# EAGLE schematic ARM926SBC (EAGLE 7.6.0)

## Sheet 1 of 3
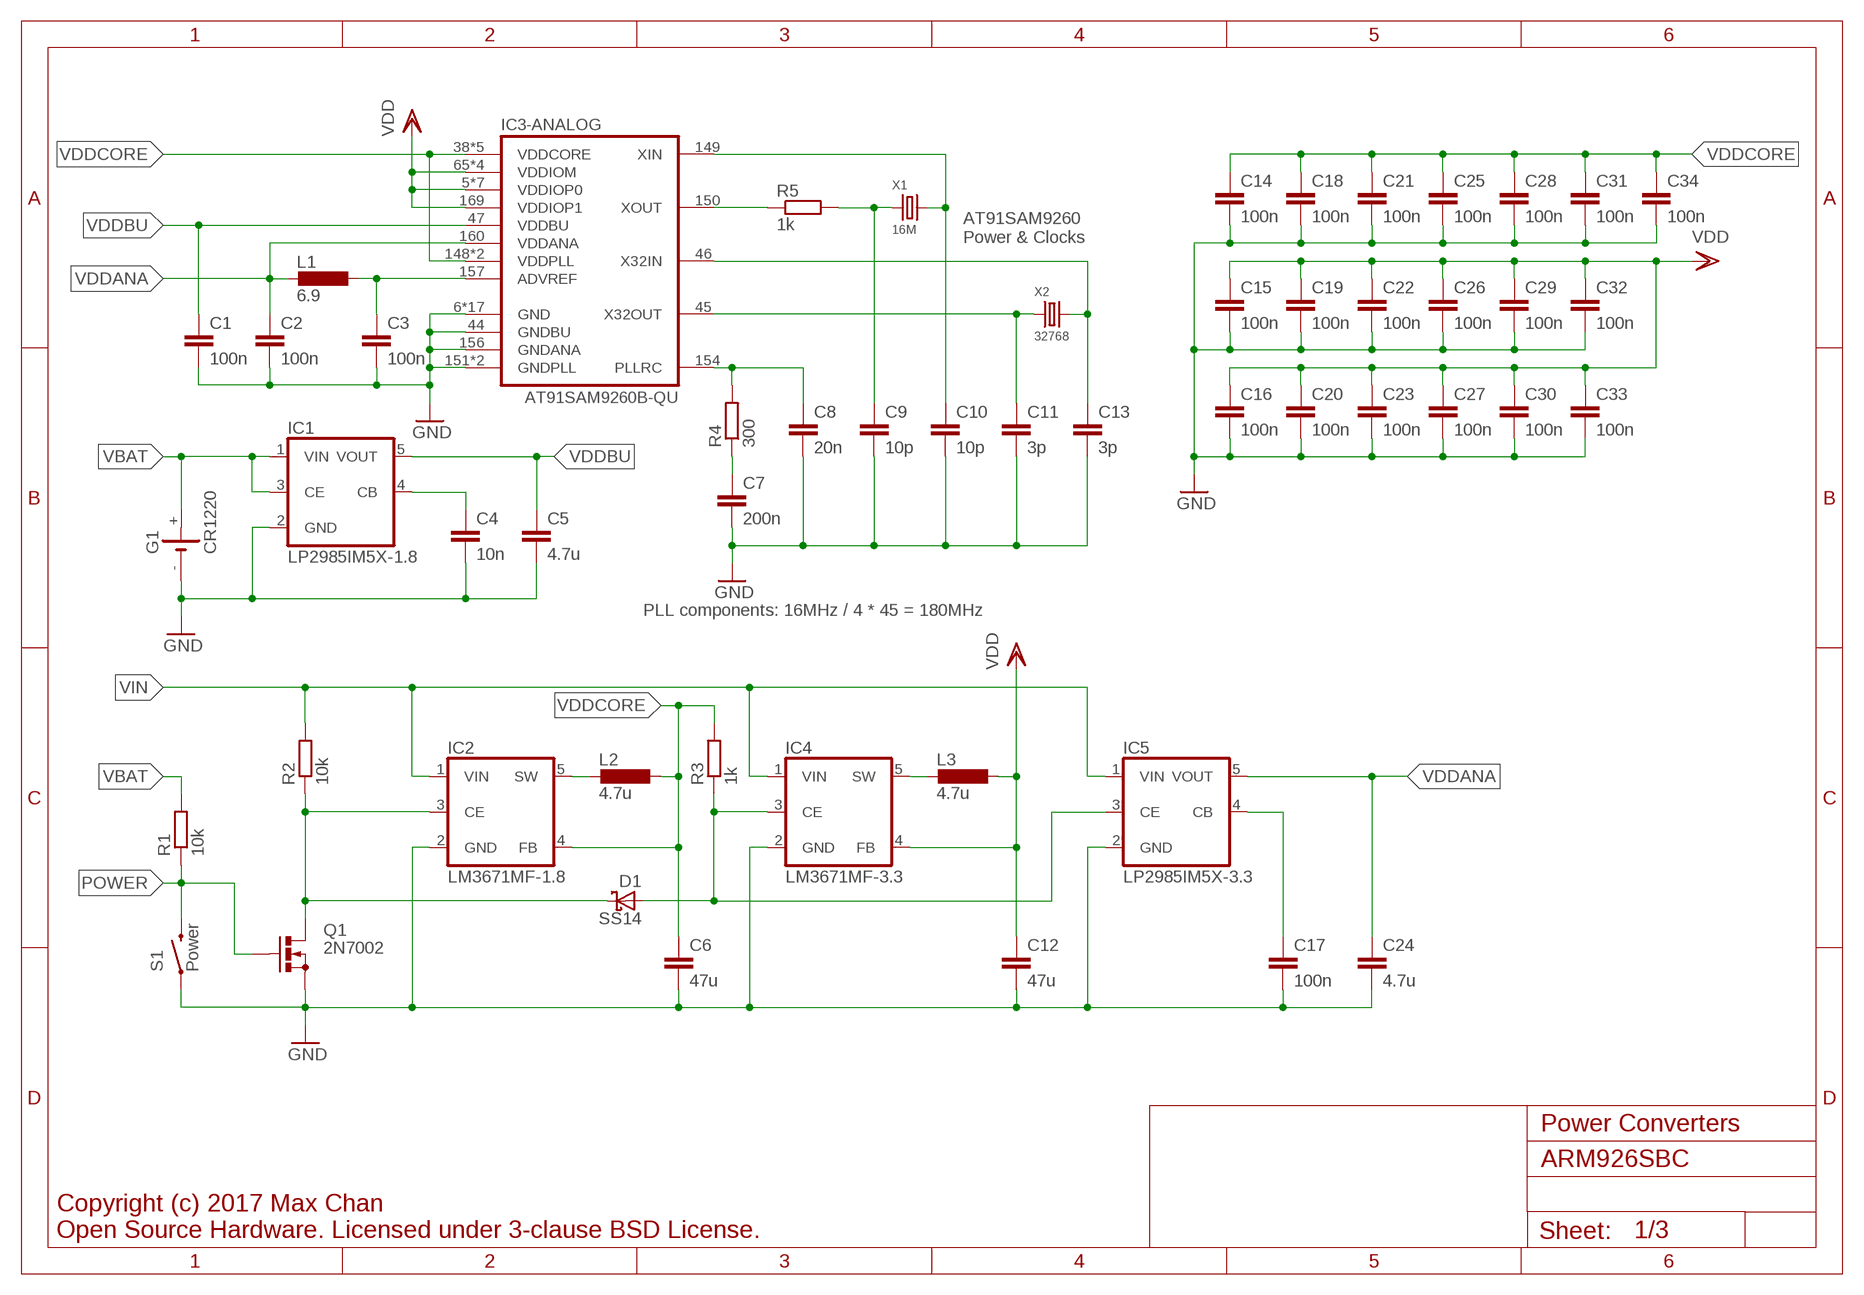
[diagram p0: schematic, sheet 1]

### Parts
C1  100n  C-EUC0603  [C0603]
C2  100n  C-EUC0603  [C0603]
C3  100n  C-EUC0603  [C0603]
C4  10n  C-EUC0603  [C0603]
C5  4.7u  C-EUC0603  [C0603]
C6  47u  C-EUC1206  [C1206]
C7  200n  C-EUC0603  [C0603]
C8  20n  C-EUC0603  [C0603]
C9  10p  C-EUC0603  [C0603]
C10  10p  C-EUC0603  [C0603]
C11  3p  C-EUC0603  [C0603]
C12  47u  C-EUC1206  [C1206]
C13  3p  C-EUC0603  [C0603]
C14  100n  C-EUC0603  [C0603]
C15  100n  C-EUC0603  [C0603]
C16  100n  C-EUC0603  [C0603]
C17  100n  C-EUC0603  [C0603]
C18  100n  C-EUC0603  [C0603]
C19  100n  C-EUC0603  [C0603]
C20  100n  C-EUC0603  [C0603]
C21  100n  C-EUC0603  [C0603]
C22  100n  C-EUC0603  [C0603]
C23  100n  C-EUC0603  [C0603]
C24  4.7u  C-EUC0603  [C0603]
C25  100n  C-EUC0603  [C0603]
C26  100n  C-EUC0603  [C0603]
C27  100n  C-EUC0603  [C0603]
C28  100n  C-EUC0603  [C0603]
C29  100n  C-EUC0603  [C0603]
C30  100n  C-EUC0603  [C0603]
C31  100n  C-EUC0603  [C0603]
C32  100n  C-EUC0603  [C0603]
C33  100n  C-EUC0603  [C0603]
C34  100n  C-EUC0603  [C0603]
D1  SS14  SCHOTTKY-DIODEDO214AC  [DO214AC]
G1  CR1220  CH291-1220LF  [CH291-1220LF]
IC1  LP2985IM5X-1.8  [SOT23-5L]
IC2  LM3671MF-1.8  [SOT23-5L]
IC3  AT91SAM9260B-QU  [PQFP208]
IC4  LM3671MF-3.3  [SOT23-5L]
IC5  LP2985IM5X-3.3  [SOT23-5L]
L1  6.9  L-EUR0603  [R0603]
L2  4.7u  L-EUL5650M  [L5650M]
L3  4.7u  L-EUL5650M  [L5650M]
Q1  2N7002  [SOT23]
R1  10k  R-EU_R0603  [R0603]
R2  10k  R-EU_R0603  [R0603]
R3  1k  R-EU_R0603  [R0603]
R4  300  R-EU_R0603  [R0603]
R5  1k  R-EU_R0603  [R0603]
S1  Power  SWITCH-MOMENTARY-2SMD-1101NE  [TACTILE-SWITCH-1101NE]
X1  16M  CRYSTAL-3225  [CRYSTAL-3225]
X2  32768  CRYSTAL-3215  [CRYSTAL-3215]

### Nets
ADVREF: C3.1 IC3.157(-ANALOG:ADVREF) L1.1
GND: C1.2 C2.2 C3.2 C4.2 C5.2 C6.2 C7.2 C8.2 C9.2 C10.2 C11.2 C12.2 C13.2 C14.2 C15.2 C16.2 C17.2 C18.2 C19.2 C20.2 C21.2 C22.2 C23.2 C24.2 C25.2 C26.2 C27.2 C28.2 C29.2 C30.2 C31.2 C32.2 C33.2 C34.2 G1.- IC1.2(GND) IC2.2(GND) IC3.6(-ANALOG:GND) IC3.14(-ANALOG:GND) IC3.25(-ANALOG:GND) IC3.33(-ANALOG:GND) IC3.39(-ANALOG:GND) IC3.44(-ANALOG:GNDBU) IC3.53(-ANALOG:GND) IC3.66(-ANALOG:GND) IC3.78(-ANALOG:GND) IC3.91(-ANALOG:GND) IC3.113(-ANALOG:GND) IC3.133(-ANALOG:GND) IC3.146(-ANALOG:GND) IC3.151(-ANALOG:GNDPLL) IC3.153(-ANALOG:GNDPLL) IC3.156(-ANALOG:GNDANA) IC3.170(-ANALOG:GND) IC3.173(-ANALOG:GND) IC3.188(-ANALOG:GND) IC3.200(-ANALOG:GND) IC3.204(-ANALOG:GND) IC4.2(GND) IC5.2(GND) Q1.2(S) S1.1 ; also sheet 2,3
N$1: C8.1 IC3.154(-ANALOG:PLLRC) R4.2
N$2: C7.1 R4.1
N$3: IC3.150(-ANALOG:XOUT) R5.1
N$4: C9.1 R5.2 X1.1
N$5: C10.1 IC3.149(-ANALOG:XIN) X1.3
N$6: C11.1 IC3.45(-ANALOG:X32OUT) X2.1
N$7: C13.1 IC3.46(-ANALOG:X32IN) X2.2
N$9: C4.1 IC1.4(CB)
N$10: D1.A IC4.3(CE) IC5.3(CE) R3.1
N$11: IC2.5(SW) L2.2
N$13: IC4.5(SW) L3.2
N$14: C17.1 IC5.4(CB)
N$15: D1.C IC2.3(CE) Q1.3(D) R2.1
POWER: Q1.1(G) R1.1 S1.2
VBAT: G1.+ IC1.1(VIN) IC1.3(CE) R1.2
VDD: C12.1 C15.1 C16.1 C19.1 C20.1 C22.1 C23.1 C26.1 C27.1 C29.1 C30.1 C32.1 C33.1 IC3.5(-ANALOG:VDDIOP0) IC3.13(-ANALOG:VDDIOP0) IC3.24(-ANALOG:VDDIOP0) IC3.32(-ANALOG:VDDIOP0) IC3.52(-ANALOG:VDDIOP0) IC3.65(-ANALOG:VDDIOM) IC3.90(-ANALOG:VDDIOM) IC3.114(-ANALOG:VDDIOM) IC3.132(-ANALOG:VDDIOM) IC3.169(-ANALOG:VDDIOP1) IC3.187(-ANALOG:VDDIOP0) IC3.199(-ANALOG:VDDIOP0) IC4.4(FB) L3.1 ; also sheet 2,3
VDDANA: C2.1 C24.1 IC3.160(-ANALOG:VDDANA) IC5.5(VOUT) L1.2
VDDBU: C1.1 C5.1 IC1.5(VOUT) IC3.47(-ANALOG:VDDBU)
VDDCORE: C6.1 C14.1 C18.1 C21.1 C25.1 C28.1 C31.1 C34.1 IC2.4(FB) IC3.38(-ANALOG:VDDCORE) IC3.77(-ANALOG:VDDCORE) IC3.147(-ANALOG:VDDCORE) IC3.148(-ANALOG:VDDPLL) IC3.155(-ANALOG:VDDPLL) IC3.174(-ANALOG:VDDCORE) IC3.203(-ANALOG:VDDCORE) L2.1 R3.2
VIN: IC2.1(VIN) IC4.1(VIN) IC5.1(VIN) R2.2
Unconnected: IC3.9(-PORTB:PB0/SPI1_MISO/TIOA3) IC3.10(-PORTB:PB1/SPI1_MOSI/TIOB3) IC3.11(-PORTB:PB2/SPI1_SCK/TIOA4) IC3.12(-PORTB:PB3/SPI1_CS0/TIOA5) IC3.15(-PORTB:PB4/TXD0) IC3.16(-PORTB:PB5/RXD0) IC3.17(-PORTB:PB6/TXD1/TCLK1) IC3.18(-PORTB:PB7/RXD1/TCLK2) IC3.19(-PORTB:PB8/TXD2) IC3.20(-PORTB:PB9/RXD2) IC3.21(-PORTB:PB14/DRXD) IC3.22(-PORTB:PB15/DTXD) IC3.23(-PORTB:PB16/TK0/TCLK3) IC3.26(-PORTB:PB17/TF0/TCLK4) IC3.27(-PORTB:PB18/TD0/TIOB4) IC3.28(-PORTB:PB19/RD0/TIOB5) IC3.29(-MISC:TDO) IC3.30(-MISC:TDI) IC3.31(-MISC:TMS) IC3.34(-MISC:TCK) IC3.35(-MISC:TRST#) IC3.36(-MISC:RST#) IC3.37(-MISC:RTCK) IC3.40(-MISC:BMS) IC3.41(-MISC:OSCSEL) IC3.42(-MISC:TST) IC3.43(-MISC:JTAGSEL) IC3.48(-MISC:WKUP) IC3.49(-MISC:SHDN) IC3.50(-MISC:HD-) IC3.51(-MISC:HD+) IC3.54(-MISC:UD-) IC3.55(-MISC:UD+) IC3.56(-PORTC:PC13/FIQ/CS#6) IC3.57(-PORTC:PC11/CS#2/SPI0_CS1) IC3.58(-PORTC:PC10/A25/CTS3) IC3.59(-PORTC:PC14/CS#3/IRQ2) IC3.60(-PORTC:PC9/CS#5/TIOB0) IC3.61(-PORTC:PC8/CS#4/RTS3) IC3.62(-PORTC:PC4/A23/SPI1_CS2) IC3.63(-PORTC:PC6/TIOB2/CFCE1) IC3.64(-PORTC:PC7/TIOB1/CFCE2) IC3.67(-PORTC:PC5/A24/SPI1_CS1) IC3.127(-PORTC:PC15/WAIT#/IRQ1) IC3.128(-PORTC:PC16/D16/SPI0_CS2) IC3.129(-PORTC:PC17/D17/SPI0_CS3) IC3.130(-PORTC:PC18/D18/SPI1_CS1) IC3.131(-PORTC:PC19/D19/SPI1_CS2) IC3.134(-PORTC:PC20/D20/SPI1_CS3) IC3.135(-PORTC:PC21/D21/EF100) IC3.136(-PORTC:PC22/D22/TCLK5) IC3.137(-PORTC:PC23/D23) IC3.138(-PORTC:PC24/D24) IC3.139(-PORTC:PC25/D25) IC3.140(-PORTC:PC26/D26) IC3.141(-PORTC:PC27/D27) IC3.142(-PORTC:PC28/D28) IC3.143(-PORTC:PC29/D29) IC3.144(-PORTC:PC30/D30) IC3.145(-PORTC:PC31/D31) IC3.158(-PORTC:PC0/ADC0/SCK3) IC3.159(-PORTC:PC1/ADC1/PCK0) IC3.161(-PORTB:PB10/TXD3/ISI_D8) IC3.162(-PORTB:PB11/RXD3/ISI_D9) IC3.163(-PORTB:PB20/RK0/ISI_D0) IC3.164(-PORTB:PB21/RF0/ISI_D1) IC3.165(-PORTB:PB22/DSR0/ISI_D2) IC3.166(-PORTB:PB23/DCD0/ISI_D3) IC3.167(-PORTB:PB24/DTR0/ISI_D4) IC3.168(-PORTB:PB25/RI0/ISI_D5) IC3.171(-PORTB:PB26/RTS0/ISI_D6) IC3.172(-PORTB:PB27/CTS0/ISI_D7) IC3.175(-PORTB:PB28/RTS1/ISI_PCK) IC3.176(-PORTB:PB29/CTS1/ISI_VSY) IC3.177(-PORTB:PB30/PCK0/ISI_HSY) IC3.178(-PORTB:PB31/PCK1)

### Notes on the sheet
- AT91SAM9260
  Power & Clocks
- PLL components: 16MHz / 4 * 45 = 180MHz
- Power Converters
- Copyright (c) 2017 Max Chan
  Open Source Hardware. Licensed under 3-clause BSD License.

## Sheet 2 of 3
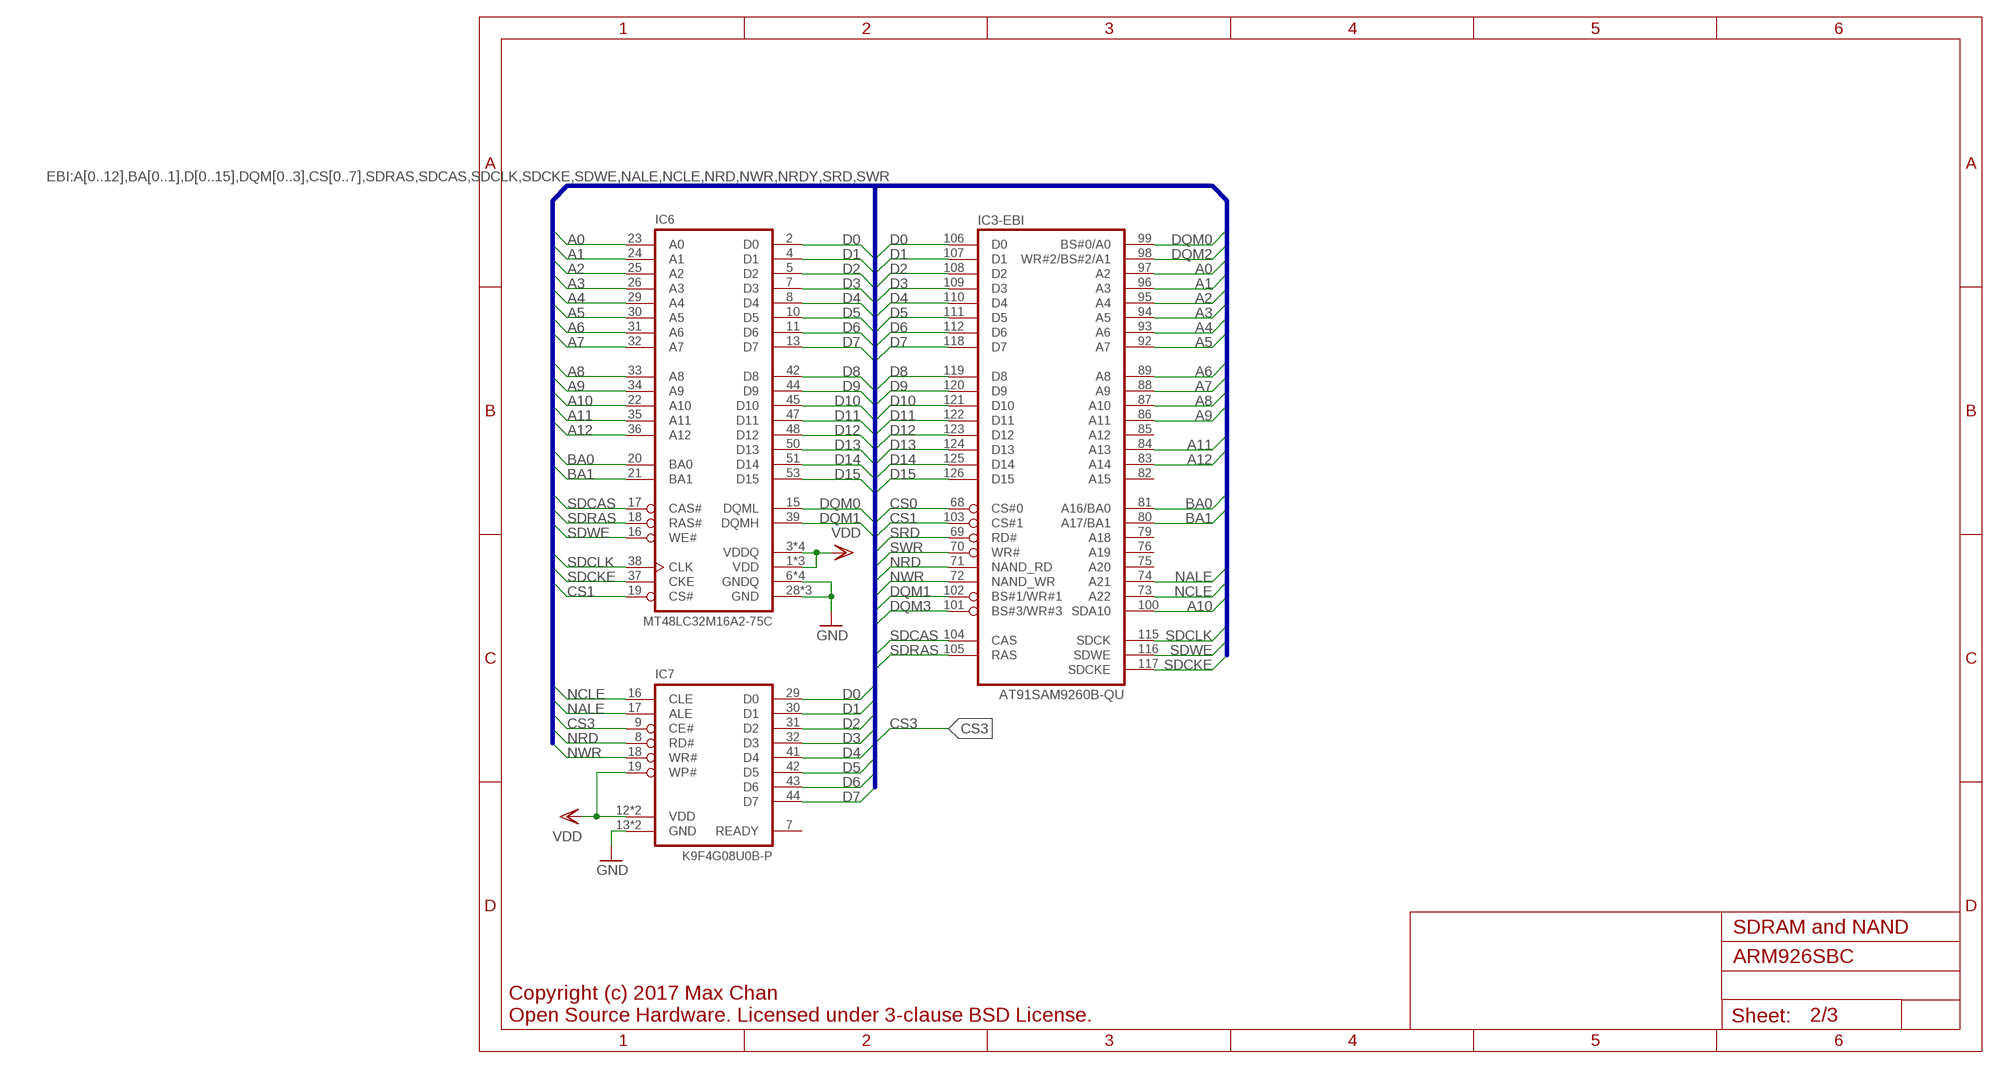
[diagram p1: schematic, sheet 2]

### Parts
IC6  MT48LC32M16A2-75C  [TSOP54-400]
IC7  K9F4G08U0B-P  [TSOP48]

### Nets
A0: IC3.97(-EBI:A2) IC6.23(A0)
A1: IC3.96(-EBI:A3) IC6.24(A1)
A2: IC3.95(-EBI:A4) IC6.25(A2)
A3: IC3.94(-EBI:A5) IC6.26(A3)
A4: IC3.93(-EBI:A6) IC6.29(A4)
A5: IC3.92(-EBI:A7) IC6.30(A5)
A6: IC3.89(-EBI:A8) IC6.31(A6)
A7: IC3.88(-EBI:A9) IC6.32(A7)
A8: IC3.87(-EBI:A10) IC6.33(A8)
A9: IC3.86(-EBI:A11) IC6.34(A9)
A10: IC3.100(-EBI:SDA10) IC6.22(A10)
A11: IC3.84(-EBI:A13) IC6.35(A11)
A12: IC3.83(-EBI:A14) IC6.36(A12)
BA0: IC3.81(-EBI:A16/BA0) IC6.20(BA0)
BA1: IC3.80(-EBI:A17/BA1) IC6.21(BA1)
CS0: IC3.68(-EBI:CS#0)
CS1: IC3.103(-EBI:CS#1) IC6.19(CS#)
CS3: IC7.9(CE#)
D0: IC3.106(-EBI:D0) IC6.2(D0) IC7.29(D0)
D1: IC3.107(-EBI:D1) IC6.4(D1) IC7.30(D1)
D2: IC3.108(-EBI:D2) IC6.5(D2) IC7.31(D2)
D3: IC3.109(-EBI:D3) IC6.7(D3) IC7.32(D3)
D4: IC3.110(-EBI:D4) IC6.8(D4) IC7.41(D4)
D5: IC3.111(-EBI:D5) IC6.10(D5) IC7.42(D5)
D6: IC3.112(-EBI:D6) IC6.11(D6) IC7.43(D6)
D7: IC3.118(-EBI:D7) IC6.13(D7) IC7.44(D7)
D8: IC3.119(-EBI:D8) IC6.42(D8)
D9: IC3.120(-EBI:D9) IC6.44(D9)
D10: IC3.121(-EBI:D10) IC6.45(D10)
D11: IC3.122(-EBI:D11) IC6.47(D11)
D12: IC3.123(-EBI:D12) IC6.48(D12)
D13: IC3.124(-EBI:D13) IC6.50(D13)
D14: IC3.125(-EBI:D14) IC6.51(D14)
D15: IC3.126(-EBI:D15) IC6.53(D15)
DQM0: IC3.99(-EBI:BS#0/A0) IC6.15(DQML)
DQM1: IC3.102(-EBI:BS#1/WR#1) IC6.39(DQMH)
DQM2: IC3.98(-EBI:WR#2/BS#2/A1)
DQM3: IC3.101(-EBI:BS#3/WR#3)
GND: IC6.6(GNDQ) IC6.12(GNDQ) IC6.28(GND) IC6.41(GND) IC6.46(GNDQ) IC6.52(GNDQ) IC6.54(GND) IC7.13(GND) IC7.36(GND) ; also sheet 1,3
NALE: IC3.74(-EBI:A21) IC7.17(ALE)
NCLE: IC3.73(-EBI:A22) IC7.16(CLE)
NRD: IC3.71(-EBI:NAND_RD) IC7.8(RD#)
NWR: IC3.72(-EBI:NAND_WR) IC7.18(WR#)
SDCAS: IC3.104(-EBI:CAS) IC6.17(CAS#)
SDCKE: IC3.117(-EBI:SDCKE) IC6.37(CKE)
SDCLK: IC3.115(-EBI:SDCK) IC6.38(CLK)
SDRAS: IC3.105(-EBI:RAS) IC6.18(RAS#)
SDWE: IC3.116(-EBI:SDWE) IC6.16(WE#)
SRD: IC3.69(-EBI:RD#)
SWR: IC3.70(-EBI:WR#)
VDD: IC6.1(VDD) IC6.3(VDDQ) IC6.9(VDDQ) IC6.14(VDD) IC6.27(VDD) IC6.43(VDDQ) IC6.49(VDDQ) IC7.12(VDD) IC7.19(WP#) IC7.37(VDD) ; also sheet 1,3
Unconnected: IC3.75(-EBI:A20) IC3.76(-EBI:A19) IC3.79(-EBI:A18) IC3.82(-EBI:A15) IC3.85(-EBI:A12) IC7.7(READY)

### Buses
EBI:A[0..12],BA[0..1],D[0..15],DQM[0..3],CS[0..7],SDRAS,SDCAS,SDCLK,SDCKE,SDWE,NALE,NCLE,NRD,NWR,NRDY,SRD,SWR

### Notes on the sheet
- SDRAM and NAND
- Copyright (c) 2017 Max Chan
  Open Source Hardware. Licensed under 3-clause BSD License.

## Sheet 3 of 3
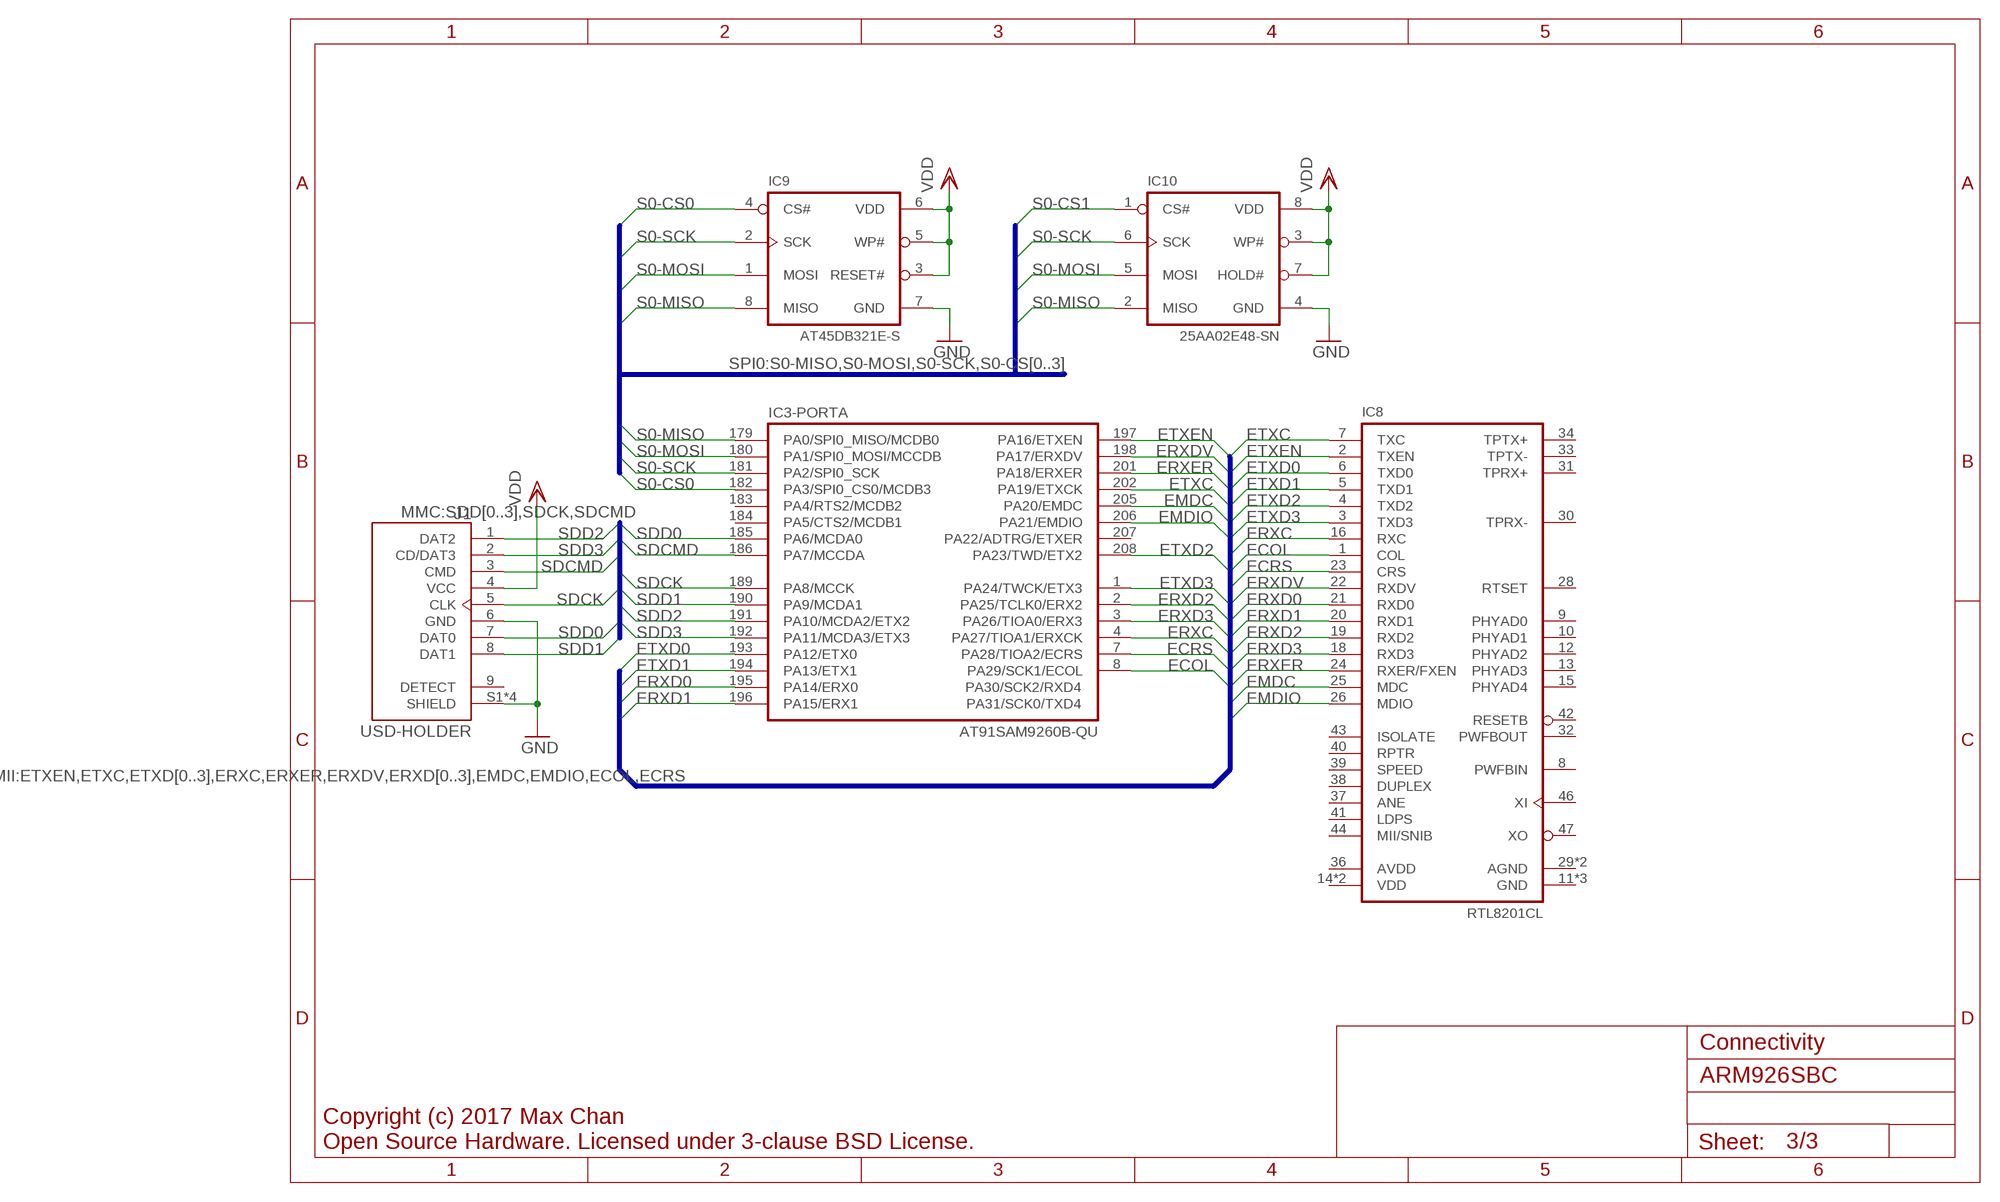
[diagram p2: schematic, sheet 3]

### Parts
IC8  RTL8201CL  [SQFP-S-7X7-48]
IC9  AT45DB321E-S  [SO-08M]
IC10  25AA02E48-SN  [SO-08]
J1  USD-HOLDER  [USD-HOLDER]

### Nets
ECOL: IC3.8(-PORTA:PA29/SCK1/ECOL) IC8.1(COL)
ECRS: IC3.7(-PORTA:PA28/TIOA2/ECRS) IC8.23(CRS)
EMDC: IC3.205(-PORTA:PA20/EMDC) IC8.25(MDC)
EMDIO: IC3.206(-PORTA:PA21/EMDIO) IC8.26(MDIO)
ERXC: IC3.4(-PORTA:PA27/TIOA1/ERXCK) IC8.16(RXC)
ERXD0: IC3.195(-PORTA:PA14/ERX0) IC8.21(RXD0)
ERXD1: IC3.196(-PORTA:PA15/ERX1) IC8.20(RXD1)
ERXD2: IC3.2(-PORTA:PA25/TCLK0/ERX2) IC8.19(RXD2)
ERXD3: IC3.3(-PORTA:PA26/TIOA0/ERX3) IC8.18(RXD3)
ERXDV: IC3.198(-PORTA:PA17/ERXDV) IC8.22(RXDV)
ERXER: IC3.201(-PORTA:PA18/ERXER) IC8.24(RXER/FXEN)
ETXC: IC3.202(-PORTA:PA19/ETXCK) IC8.7(TXC)
ETXD0: IC3.193(-PORTA:PA12/ETX0) IC8.6(TXD0)
ETXD1: IC3.194(-PORTA:PA13/ETX1) IC8.5(TXD1)
ETXD2: IC3.208(-PORTA:PA23/TWD/ETX2) IC8.4(TXD2)
ETXD3: IC3.1(-PORTA:PA24/TWCK/ETX3) IC8.3(TXD3)
ETXEN: IC3.197(-PORTA:PA16/ETXEN) IC8.2(TXEN)
GND: IC9.7(GND) IC10.4(GND) J1.6(GND) J1.S1(SHIELD) J1.S2(SHIELD) J1.S3(SHIELD) J1.S4(SHIELD) ; also sheet 1,2
S0-CS0: IC3.182(-PORTA:PA3/SPI0_CS0/MCDB3) IC9.4(CS#)
S0-CS1: IC10.1(CS#)
S0-MISO: IC3.179(-PORTA:PA0/SPI0_MISO/MCDB0) IC9.8(MISO) IC10.2(MISO)
S0-MOSI: IC3.180(-PORTA:PA1/SPI0_MOSI/MCCDB) IC9.1(MOSI) IC10.5(MOSI)
S0-SCK: IC3.181(-PORTA:PA2/SPI0_SCK) IC9.2(SCK) IC10.6(SCK)
SDCK: IC3.189(-PORTA:PA8/MCCK) J1.5(CLK)
SDCMD: IC3.186(-PORTA:PA7/MCCDA) J1.3(CMD)
SDD0: IC3.185(-PORTA:PA6/MCDA0) J1.7(DAT0)
SDD1: IC3.190(-PORTA:PA9/MCDA1) J1.8(DAT1)
SDD2: IC3.191(-PORTA:PA10/MCDA2/ETX2) J1.1(DAT2)
SDD3: IC3.192(-PORTA:PA11/MCDA3/ETX3) J1.2(CD/DAT3)
VDD: IC9.3(RESET#) IC9.5(WP#) IC9.6(VDD) IC10.3(WP#) IC10.7(HOLD#) IC10.8(VDD) J1.4(VCC) ; also sheet 1,2
Unconnected: IC3.183(-PORTA:PA4/RTS2/MCDB2) IC3.184(-PORTA:PA5/CTS2/MCDB1) IC3.207(-PORTA:PA22/ADTRG/ETXER) IC8.8(PWFBIN) IC8.9(PHYAD0) IC8.10(PHYAD1) IC8.12(PHYAD2) IC8.13(PHYAD3) IC8.15(PHYAD4) IC8.28(RTSET) IC8.30(TPRX-) IC8.31(TPRX+) IC8.32(PWFBOUT) IC8.33(TPTX-) IC8.34(TPTX+) IC8.37(ANE) IC8.38(DUPLEX) IC8.39(SPEED) IC8.40(RPTR) IC8.41(LDPS) IC8.42(RESETB) IC8.43(ISOLATE) IC8.44(MII/SNIB) IC8.46(XI) IC8.47(XO) J1.9(DETECT)

### Buses
MII:ETXEN,ETXC,ETXD[0..3],ERXC,ERXER,ERXDV,ERXD[0..3],EMDC,EMDIO,ECOL,ECRS
MMC:SDD[0..3],SDCK,SDCMD
SPI0:S0-MISO,S0-MOSI,S0-SCK,S0-CS[0..3]

### Notes on the sheet
- Connectivity
- Copyright (c) 2017 Max Chan
  Open Source Hardware. Licensed under 3-clause BSD License.

## Power pins joined to a net without a drawn wire
AGND: IC8.29(AGND) IC8.35(AGND)
AVDD: IC8.36(AVDD)
GND: IC8.11(GND) IC8.17(GND) IC8.45(GND)
VDD: IC8.14(VDD) IC8.48(VDD)

## Library data of the parts
C1-C34 = rcl:C-EU: CAPACITOR, European symbol
D1 = diode:SCHOTTKY-DIODE: Schottky Diode
G1 = battery:CH291-1220LF: Battery Holder, SMT, 12mm multicomp PART NO. CH291-1220LF Source: Data sheet <http://www.farnell.com/datasheets/1505860.pdf>
IC1 IC5 = ARM926SBC:LP2985?: Low-dropout Linear Regulator, Fixed Voltage
IC2 IC4 = ARM926SBC:LM3671?: Integrated Switch Synchronous Buck Converter
IC3 = ARM926SBC:AT91SAM9260: ARM926EJ-S Microprocessor, 200MHz
IC6 = ARM926SBC:MT48LC32M16A2: SDR SDRAM, PC-133 CL3, 64MB, 16-bit
IC7 = ARM926SBC:K9F4G08U0*: NAND Flash, SLC, 512MB
IC8 = ARM926SBC:RTL8201C: Fast Ethernet PHY
IC9 = ARM926SBC:AT45DB*1E: SPI DataFlash, 256kB/512kB/1MB/2MB/4MB/8MB
IC10 = ARM926SBC:25AA02E*: SPI EEPROM with MAC, 256 Bytes
J1 = ARM926SBC:USD-HOLDER
L1-L3 = rcl:L-EU: INDUCTOR, European symbol
Q1 = ARM926SBC:2N7002: NMOSFET
R1-R5 = rcl:R-EU_: RESISTOR, European symbol
S1 = SparkFun-Electromechanical:SWITCH-MOMENTARY-2: Various NO switches- pushbuttons, reed, etc; PROD_ID: SWCH-00815
X1 X2 = ARM926SBC:CRYSTAL